# EAGLE design USB_Micro_Power_to_lab_board_2015-11-16 (EAGLE 7.4.0)
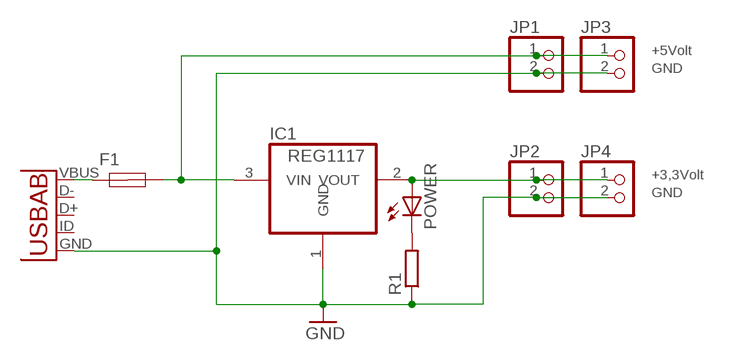
[diagram p0: schematic, sheet 1]

## Parts
F1  LITTELFUSE_1812_500MA  [R1812]
IC1  REG1117  [SOT223]
JP1  PINHD-1X2  [1X02]
JP2  PINHD-1X2  [1X02]
JP3  PINHD-1X2  [1X02]
JP4  PINHD-1X2  [1X02]
POWER  LED3MM  [LED3MM]
R1  R-EU_0204/5  [0204/5]
U1  USB-ABUSB-AB-MICRO-SMD  [USB-AB-MICRO-SMD_VO2]

## Nets
GND: IC1.1(GND) JP1.2 JP2.2 JP3.2 JP4.2 R1.1 U1.GND
N$1: F1.2 IC1.3(VIN) JP1.1 JP3.1
N$2: F1.1 U1.VBUS
N$4: POWER.K(C) R1.2
N$5: IC1.2(VOUT) JP2.1 JP4.1 POWER.A
Unconnected: U1.D+ U1.D- U1.ID(USBID)

## Notes on the sheet
- +5Volt
- GND
- +3,3Volt
- GND

## Library data of the parts
F1 = fuses_polyswitch:LITTELFUSE_1812; MPN: 1812L050PR; OC_FARNELL: 1597001; PACKAGE: 1812; SUPPLIER: LITTELFUSE
IC1 = burr-brown:REG1117: 800mA and 1A Low Dropout (LDO) Positive Regulator 1.8V, 2.5V, 2.85V, 3.3V, 5V, and Adj; MPN: REG1117; OC_FARNELL: 1097566; OC_NEWARK: 14P6981
JP1-JP4 = pinhead:PINHD-1X2: PIN HEADER
POWER = led:LED: LED OSRAM: - CHIPLED LG R971, LG N971, LY N971, LG Q971, LY Q971, LO R971, LY R971 LH N974, LH R974 LS Q976, LO Q976, LY Q976 LO Q996 - Hyper CHIPLED LW Q18S LB Q993, LB Q99A, LB R99A - SideLED LS A670, LO A670, LY A670, LG A670, LP A670 LB A673, LV A673, LT A673, LW A673 LH A674 LY A675 LS A676, LA A676, LO A676, LY A676, LW A676 LS A679, LY A679, LG A679 - Hyper Micro SIDELED® LS Y876, LA Y876, LO Y876, LY Y876 LT Y87S - SmartLED LW L88C, LW L88S LB L89C, LB L89S, LG L890 LS L89K, LO L89K, LY L89K LS L896, LA L896, LO L896, LY L896 - TOPLED LS T670, LO T670, LY T670, LG T670, LP T670 LSG T670, LSP T670, LSY T670, LOP T670, LYG T670 LG T671, LOG T671, LSG T671 LB T673, LV T673, LT T673, LW T673 LH T674 LS T676, LA T676, LO T676, LY T676, LB T676, LH T676, LSB T676, LW T676 LB T67C, LV T67C, LT T67C, LS T67K, LO T67K, LY T67K, LW E67C LS E67B, LA E67B, LO E67B, LY E67B, LB E67C, LV E67C, LT E67C LW T67C LS T679, LY T679, LG T679 LS T770, LO T770, LY T770, LG T770, LP T770 LB T773, LV T773, LT T773, LW T773 LH T774 LS E675, LA E675, LY E675, LS T675 LS T776, LA T776, LO T776, LY T776, LB T776 LHGB T686 LT T68C, LB T68C - Hyper Mini TOPLED® LB M676 - Mini TOPLED Santana® LG M470 LS M47K, LO M47K, LY M47K Source: http://www.osram.convergy.de LUXEON: - LUMILED® LXK2-PW12-R00, LXK2-PW12-S00, LXK2-PW14-U00, LXK2-PW14-V00 LXK2-PM12-R00, LXK2-PM12-S00, LXK2-PM14-U00 LXK2-PE12-Q00, LXK2-PE12-R00, LXK2-PE12-S00, LXK2-PE14-T00, LXK2-PE14-U00 LXK2-PB12-K00, LXK2-PB12-L00, LXK2-PB12-M00, LXK2-PB14-N00, LXK2-PB14-P00, LXK2-PB14-Q00 LXK2-PR12-L00, LXK2-PR12-M00, LXK2-PR14-Q00, LXK2-PR14-R00 LXK2-PD12-Q00, LXK2-PD12-R00, LXK2-PD12-S00 LXK2-PH12-R00, LXK2-PH12-S00 LXK2-PL12-P00, LXK2-PL12-Q00, LXK2-PL12-R00 Source: www.luxeon.com KINGBRIGHT: KA-3528ASYC Source: www.kingbright.com
R1 = resistor:R-EU_: RESISTOR, European symbol
U1 = Testing:USB-AB: This is a USB AB connector that is compatible with USB OTG. i.e. this connector can serve as a host or device

## Board
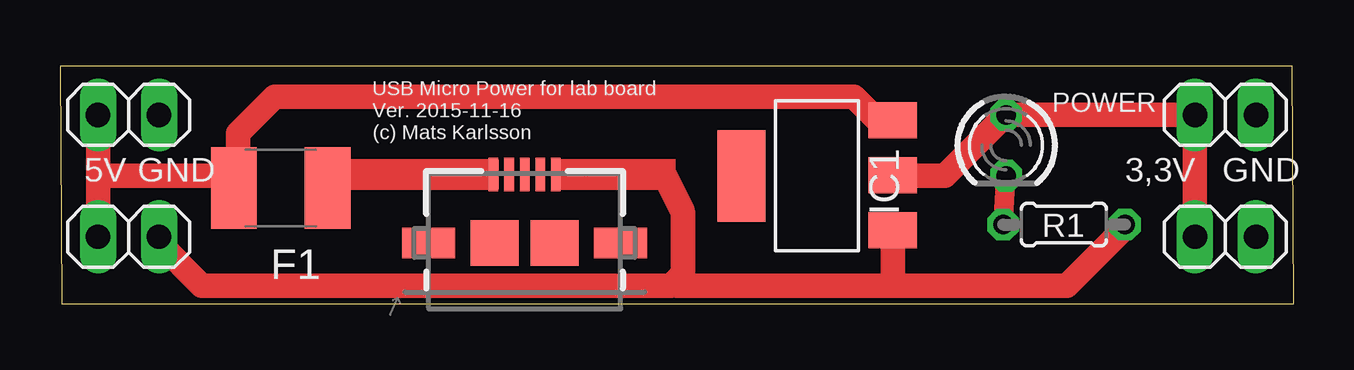
[diagram p1: board, top side]
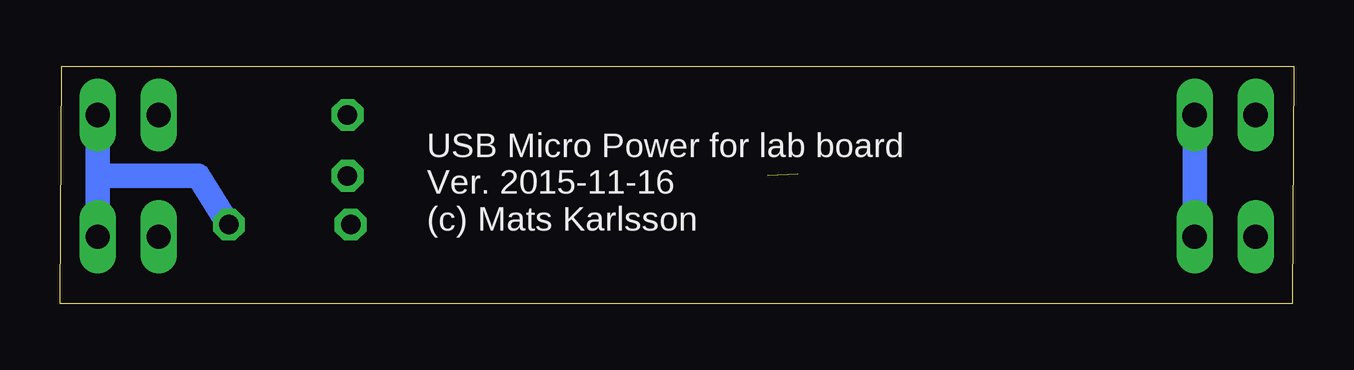
[diagram p2: board, bottom side, seen from below]

Size 51.42 x 9.9 mm. Coordinates in mm from the lower left corner, seen from the top.
Outline: 0.06,0 51.42,0 51.36,9.9 0,9.9 0.06,0
Copper layers (1*16): Top 0.035mm / dielectric 1.5mm / Bottom 0.035mm
Design rules "default": minimum track width 10mil, minimum drill 24mil, track to track 8mil, track to pad 8mil, pad to pad 8mil, via to via 8mil, smd to smd 8mil, copper to edge 40mil, drill to drill 8mil, minimum pad ring 10mil, minimum via ring 8mil, stop-mask expansion 4mil, vias tented up to drill 0mil, thermal gap 10mil

### Footprints (pad centres in the part's own frame; a part is rotated, then mirrored left to right if it is on the bottom)
R1812 = smd 1.9 x 3.4: 1 -1.95,0; 2 1.95,0
SOT223 = smd 1.499 x 2.007: 1 -2.261,-3.15; 2 0.025,-3.15; 3 2.311,-3.15 | smd 3.81 x 2.007: 4 0,3.15
1X02 = drill 1.016 long: 1 -1.27,0; 2 1.27,0
LED3MM = drill 0.813 octagon: A -1.27,0; K 1.27,0
0204/5 = drill 0.813 octagon: 1 -2.54,0; 2 2.54,0
USB-AB-MICRO-SMD_VO2 = smd 1.4 x 0.4: D+ 2.85,0; D- 2.85,0.65; GND 2.85,-1.3; ID 2.85,-0.65; VBUS 2.85,1.3 | smd 1.9 x 2: P$6 0,1.25; P$7 0,-1.25 | smd 1.27 x 2.2: P$8 0,4; P$9 0,-4

### Placement (x,y rotation side)
F1  9.21,4.83 180 top
IC1  31.56,5.33 90 top
JP1  2.86,7.87 0 top
JP2  48.58,7.87 0 top
JP3  2.86,2.79 0 top
JP4  48.58,2.79 0 top
POWER  39.43,6.6 270 top
R1  41.85,3.3 180 top
U1  19.37,2.54 90 top

### Tracks (layer width: path | path; a pad name or v marks a point on that pad's centre or on a via)
GND  (1 unrouted)
  Top 1.016: JP3.2 4.13,2.54 5.91,0.76 25.46,0.76 25.59,0.89 | 25.59,0.89 25.97,1.27 25.97,3.81 25.21,5.33 21.91,5.33 | 25.59,0.89 25.72,0.76 34.61,0.76 34.71,0.86 IC1.1 34.71,0.76 41.97,0.76 44.51,3.3 R1.1
  Bottom 1.016: JP1.2 JP3.2 | JP4.2 49.85,5.33 | 49.85,5.33 JP2.2 | R1.1 45.66,5.33 49.85,5.33
N$1
  Top 1.016: IC1.3 34.07,7.64 33.08,8.64 8.95,8.64 7.43,7.11 7.43,5 F1.2 7.26,5.25 7.18,5.33 1.59,5.33 | 1.59,5.33 JP1.1 | 1.59,5.33 JP3.1
N$2
  Top 0.406: 11.16,5.14 U1.VBUS 11.16,5.14 | 11.16,5.14 F1.1
N$4
  Top 0.813: R1.2 POWER.K
N$5
  Top 1.016: JP4.1 JP2.1 POWER.A 36.89,5.33 34.71,5.33 IC1.2
(copper drawn outside any net)
  shapes: Top area x2

### Text on the board
tPlace: USB Micro Power for lab board / Ver. 2015-11-16 / (c) Mats Karlsson
bPlace: USB Micro Power for lab board / Ver. 2015-11-16 / (c) Mats Karlsson
tNames: 5V | GND | 3,3V | GND